# EAGLE design bjt_h-bridge (EAGLE 5.06)
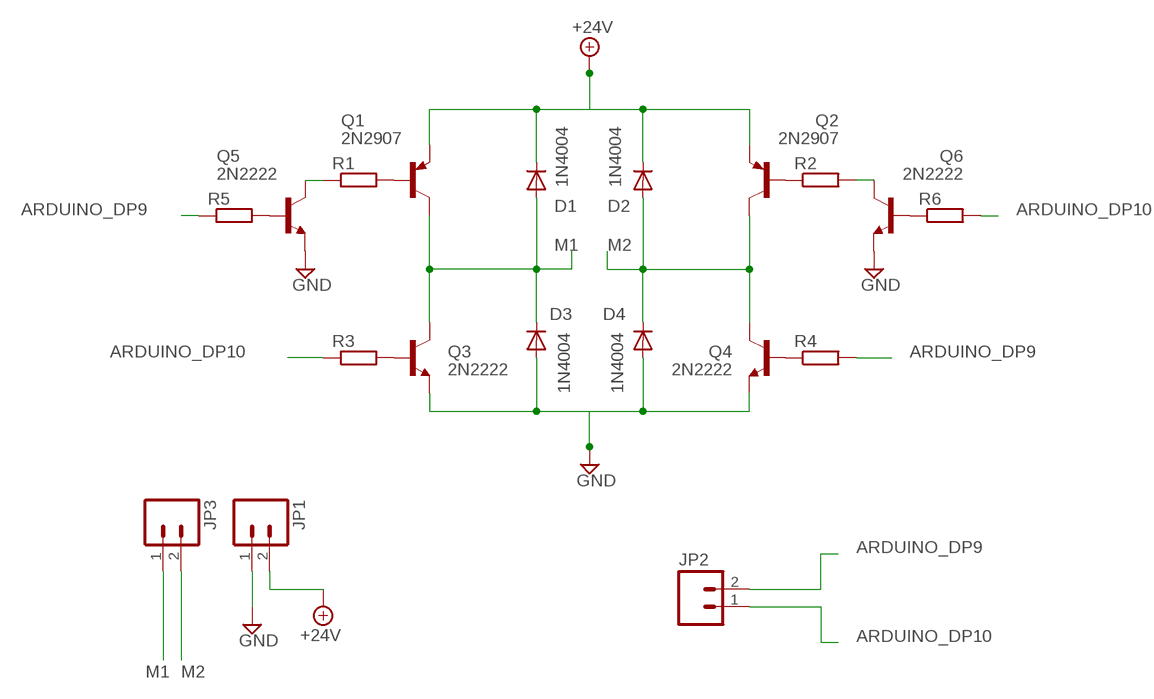
[diagram p0: schematic, sheet 1]

## Parts
D1  1N4004  [DO41-10]
D2  1N4004  [DO41-10]
D3  1N4004  [DO41-10]
D4  1N4004  [DO41-10]
JP1  M02POLAR  [MOLEX-1X2]
JP2  M02POLAR_LOCK  [MOLEX-1X2_LOCK]
JP3  M02POLAR  [MOLEX-1X2]
Q1  2N2907  [TO18]
Q2  2N2907  [TO18]
Q3  2N2222  [TO18]
Q4  2N2222  [TO18]
Q5  2N2222  [TO18]
Q6  2N2222  [TO18]
R1  R-EU_0204/5  [0204/5]
R2  R-EU_0204/5  [0204/5]
R3  R-EU_0204/7  [0204/7]
R4  R-EU_0204/5  [0204/5]
R5  R-EU_0204/5  [0204/5]
R6  R-EU_0204/5  [0204/5]

## Nets
+24V: D1.C D2.C JP1.2 Q1.1(E) Q2.1(E)
ARDUINO_DP9: JP2.2 R4.2 R5.1
ARDUINO_DP10: JP2.1 R3.1 R6.2
GND: D3.A D4.A JP1.1 Q3.1(E) Q4.1(E) Q5.1(E) Q6.1(E)
M1: D1.A D3.C JP3.1 Q1.3(C) Q3.3(C)
M2: D2.A D4.C JP3.2 Q2.3(C) Q4.3(C)
N$1: Q5.2(B) R5.2
N$2: Q5.3(C) R1.1
N$3: Q1.2(B) R1.2
N$4: Q3.2(B) R3.2
N$5: Q2.2(B) R2.1
N$10: Q4.2(B) R4.1
N$12: Q6.3(C) R2.2
N$13: Q6.2(B) R6.1

## Library data of the parts
D1-D4 = diode:1N4004: DIODE general purpose rectifier, 1 A
JP1-JP3 = SparkFun:M02: Header 2 Standard 2-pin 0.1" header. Use with straight break away headers (SKU : PRT-00116), right angle break away headers (PRT-00553), swiss pins (PRT-00743), machine pins (PRT-00117), and female headers (PRT-00115). Molex polarized connector foot print use with SKU : PRT-08233 with associated crimp pins and housings.
Q1 Q2 = transistor-pnp:2N2907*: PNP Transistor
Q3-Q6 = transistor:2N2222: NPN TRANSISTOR
R1-R6 = rcl:R-EU_: RESISTOR, European symbol

## Board
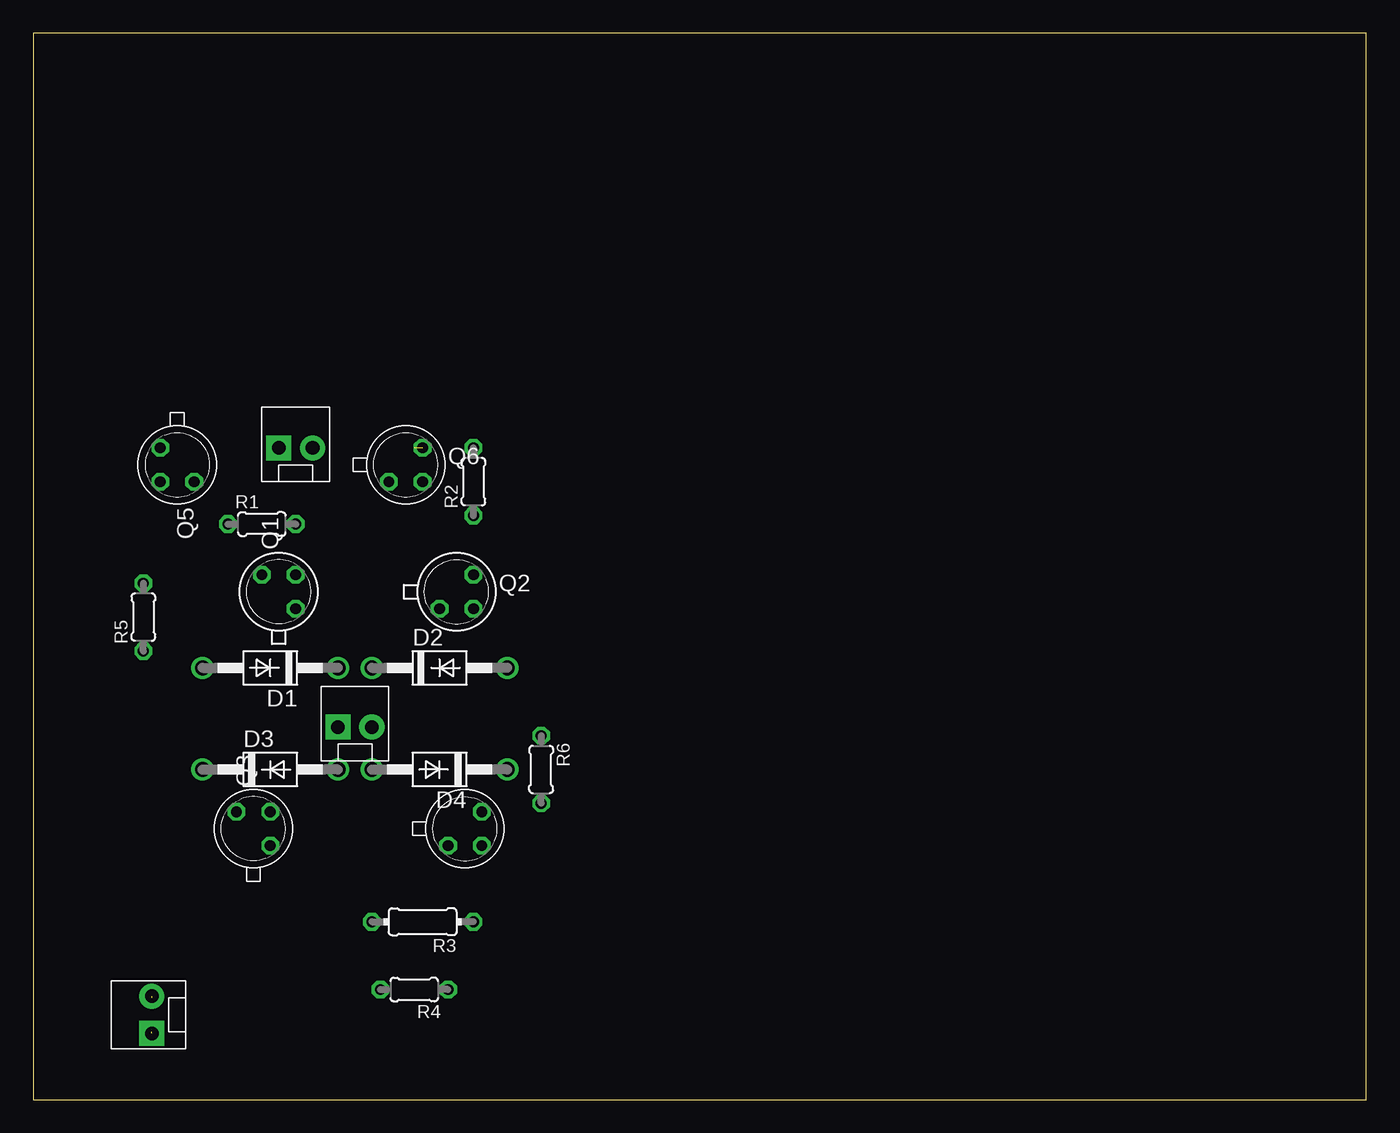
[diagram p1: board, top side]
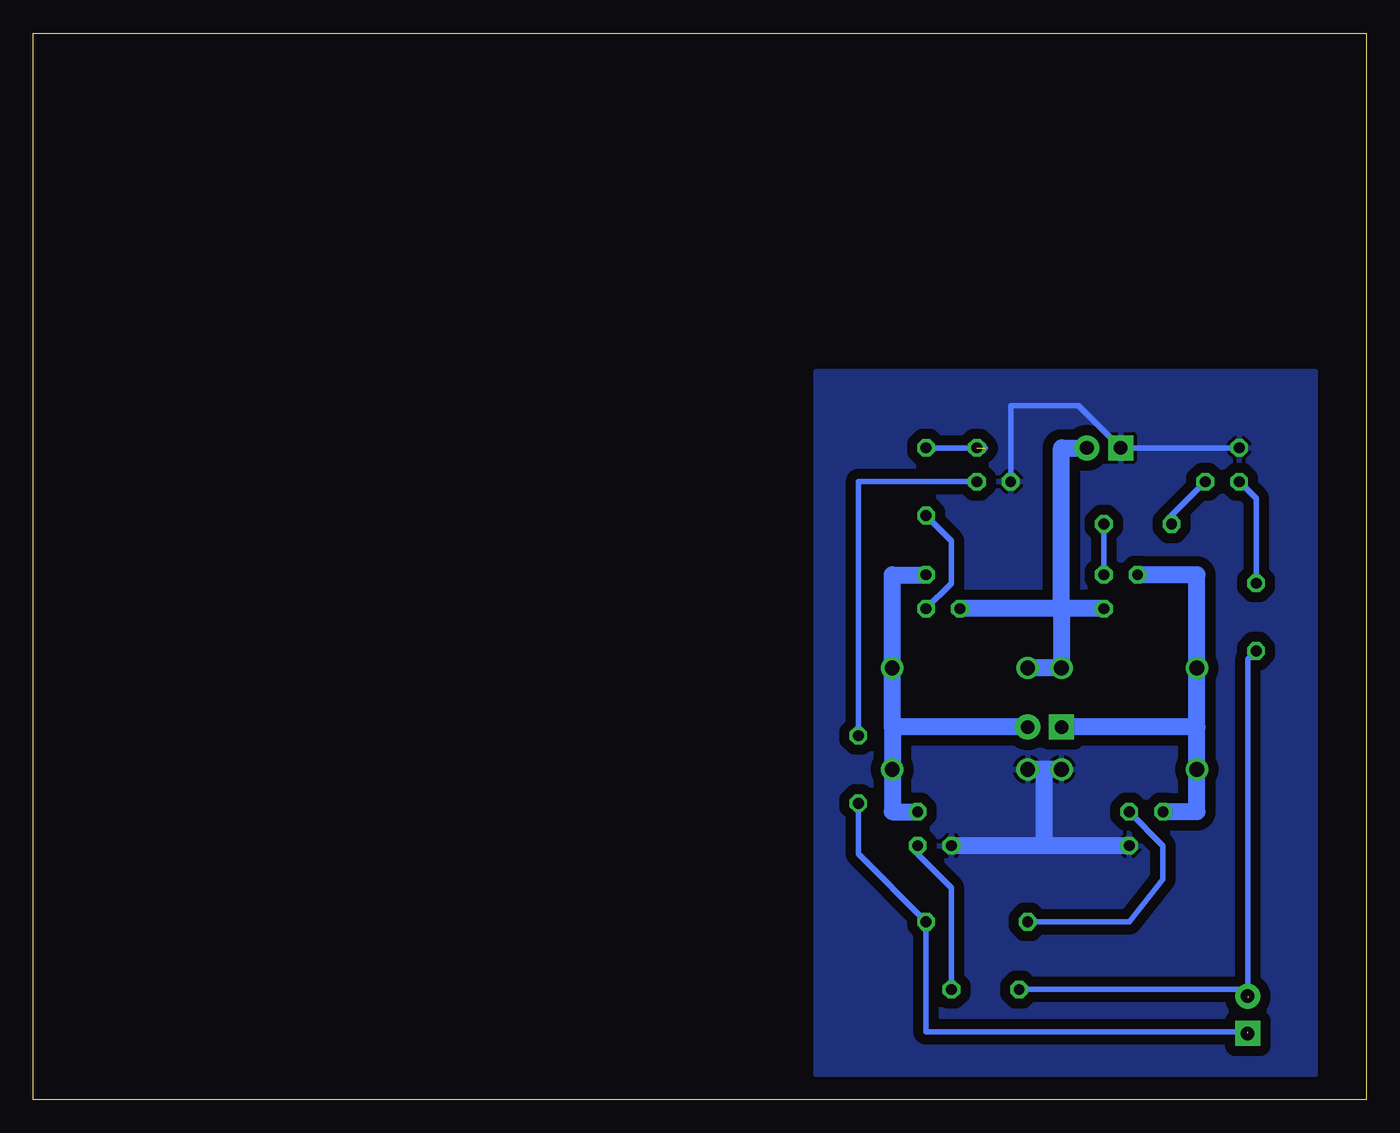
[diagram p2: board, bottom side, seen from below]

Size 100 x 80 mm. Coordinates in mm from the lower left corner, seen from the top.
Outline: 0,0 100,0 100,80 0,80 0,0
Copper layers (1*16): Top 0.035mm / dielectric 1.5mm / Bottom 0.035mm
Design rules "default *": minimum track width 10mil, minimum drill 24mil, track to track 30mil, track to pad 30mil, pad to pad 8mil, via to via 8mil, smd to smd 8mil, copper to edge 40mil, drill to drill 8mil, minimum pad ring 10mil, minimum via ring 8mil, stop-mask expansion 4mil, vias tented up to drill 0mil, thermal gap 10mil

### Footprints (pad centres in the part's own frame; a part is rotated, then mirrored left to right if it is on the bottom)
DO41-10 = drill 1.118 round: A 5.08,0; C -5.08,0
MOLEX-1X2 = drill 1.016 pad 1.88 square: 1 0,0 | drill 1.016 pad 1.88 round: 2 2.54,0
MOLEX-1X2_LOCK = drill 1.016 pad 1.88 square: 1 -0.127,0 | drill 1.016 pad 1.88 round: 2 2.667,0
TO18 = drill 0.813 octagon: 1 -1.27,-1.27; 2 1.27,-1.27; 3 1.27,1.27
0204/5 = drill 0.813 octagon: 1 -2.54,0; 2 2.54,0
0204/7 = drill 0.813 octagon: 1 -3.81,0; 2 3.81,0

### Placement (x,y rotation side)
D1  17.78,32.38 180 top
D2  30.48,32.38 0 top
D3  17.78,24.77 0 top
D4  30.48,24.77 180 top
JP1  18.41,48.9 0 top
JP2  8.89,5.08 90 top
JP3  22.86,27.94 0 top
Q1  18.41,38.1 90 top
Q2  31.75,38.1 0 top
Q3  16.51,20.32 90 top
Q4  32.38,20.32 0 top
Q5  10.79,47.62 270 top
Q6  27.94,47.62 0 top
R1  17.14,43.18 0 top
R2  33.02,46.35 90 top
R3  29.21,13.34 180 top
R4  28.57,8.26 180 top
R5  8.26,36.2 90 top
R6  38.1,24.77 270 top

### Tracks (layer width: path | path; a pad name or v marks a point on that pad's centre or on a via)
+24V
  Bottom 0.406: D1.C D2.C
  Bottom 1.27: JP1.2 22.86,48.9 22.86,36.83 | Q1.1 22.86,36.83 | D2.C D1.C 22.86,36.83 | 22.86,36.83 Q2.1
ARDUINO_DP9  (1 unrouted)
  Bottom 0.406: R5.1 8.89,33.02 8.89,8.26 | 8.89,8.26 8.89,7.62 | 8.89,8.26 R4.2
ARDUINO_DP10  (1 unrouted)
  Bottom 0.406: R6.2 38.1,18.41 R3.1 33.02,5.08 8.89,5.08
GND
  Bottom 0.406: 24.13,19.05 24.13,24.77 | 24.13,24.77 D3.A | 24.13,24.77 D4.A | Q6.1 26.67,52.07 21.59,52.07 JP1.1 Q5.1
  Bottom 1.27: Q3.1 24.13,19.05 | D3.A D4.A | 24.13,19.05 24.13,24.77 | 24.13,19.05 Q4.1
  pour Bottom: 3.81,1.91 3.81,54.61 41.27,54.61 41.27,1.91
M1
  Bottom 1.27: Q1.3 12.7,39.37 D1.A 12.7,27.94 | 12.7,27.94 D3.C 12.7,21.59 Q3.3 | 12.7,27.94 JP3.1
M2
  Bottom 1.27: Q4.3 35.56,21.59 D4.C 35.56,27.94 | 35.56,27.94 D2.A 35.56,39.37 Q2.3 | JP3.2 35.56,27.94
N$1
  Bottom 0.406: Q5.2 8.26,45.09 R5.2
N$2
  Bottom 0.406: Q5.3 14.61,43.81 R1.1
N$3
  Bottom 0.406: Q1.2 R1.2
N$4
  Bottom 0.406: Q3.2 15.24,19.05 15.24,16.51 17.78,13.34 R3.2
N$5
  Bottom 0.406: R2.1 31.11,41.91 31.11,38.73 Q2.2
N$10
  Bottom 0.406: R4.1 31.11,15.88 33.66,18.41 Q4.2
N$12  (1 unrouted)
  Bottom 0.406: 28.57,48.9 R2.2
N$13
  Bottom 0.406: R6.1 38.1,46.35 Q6.2